# EAGLE design HHPrototype (EAGLE 7.7.0)
HHPrototype

## Sheet 1 of 2: HH Prototype Shield
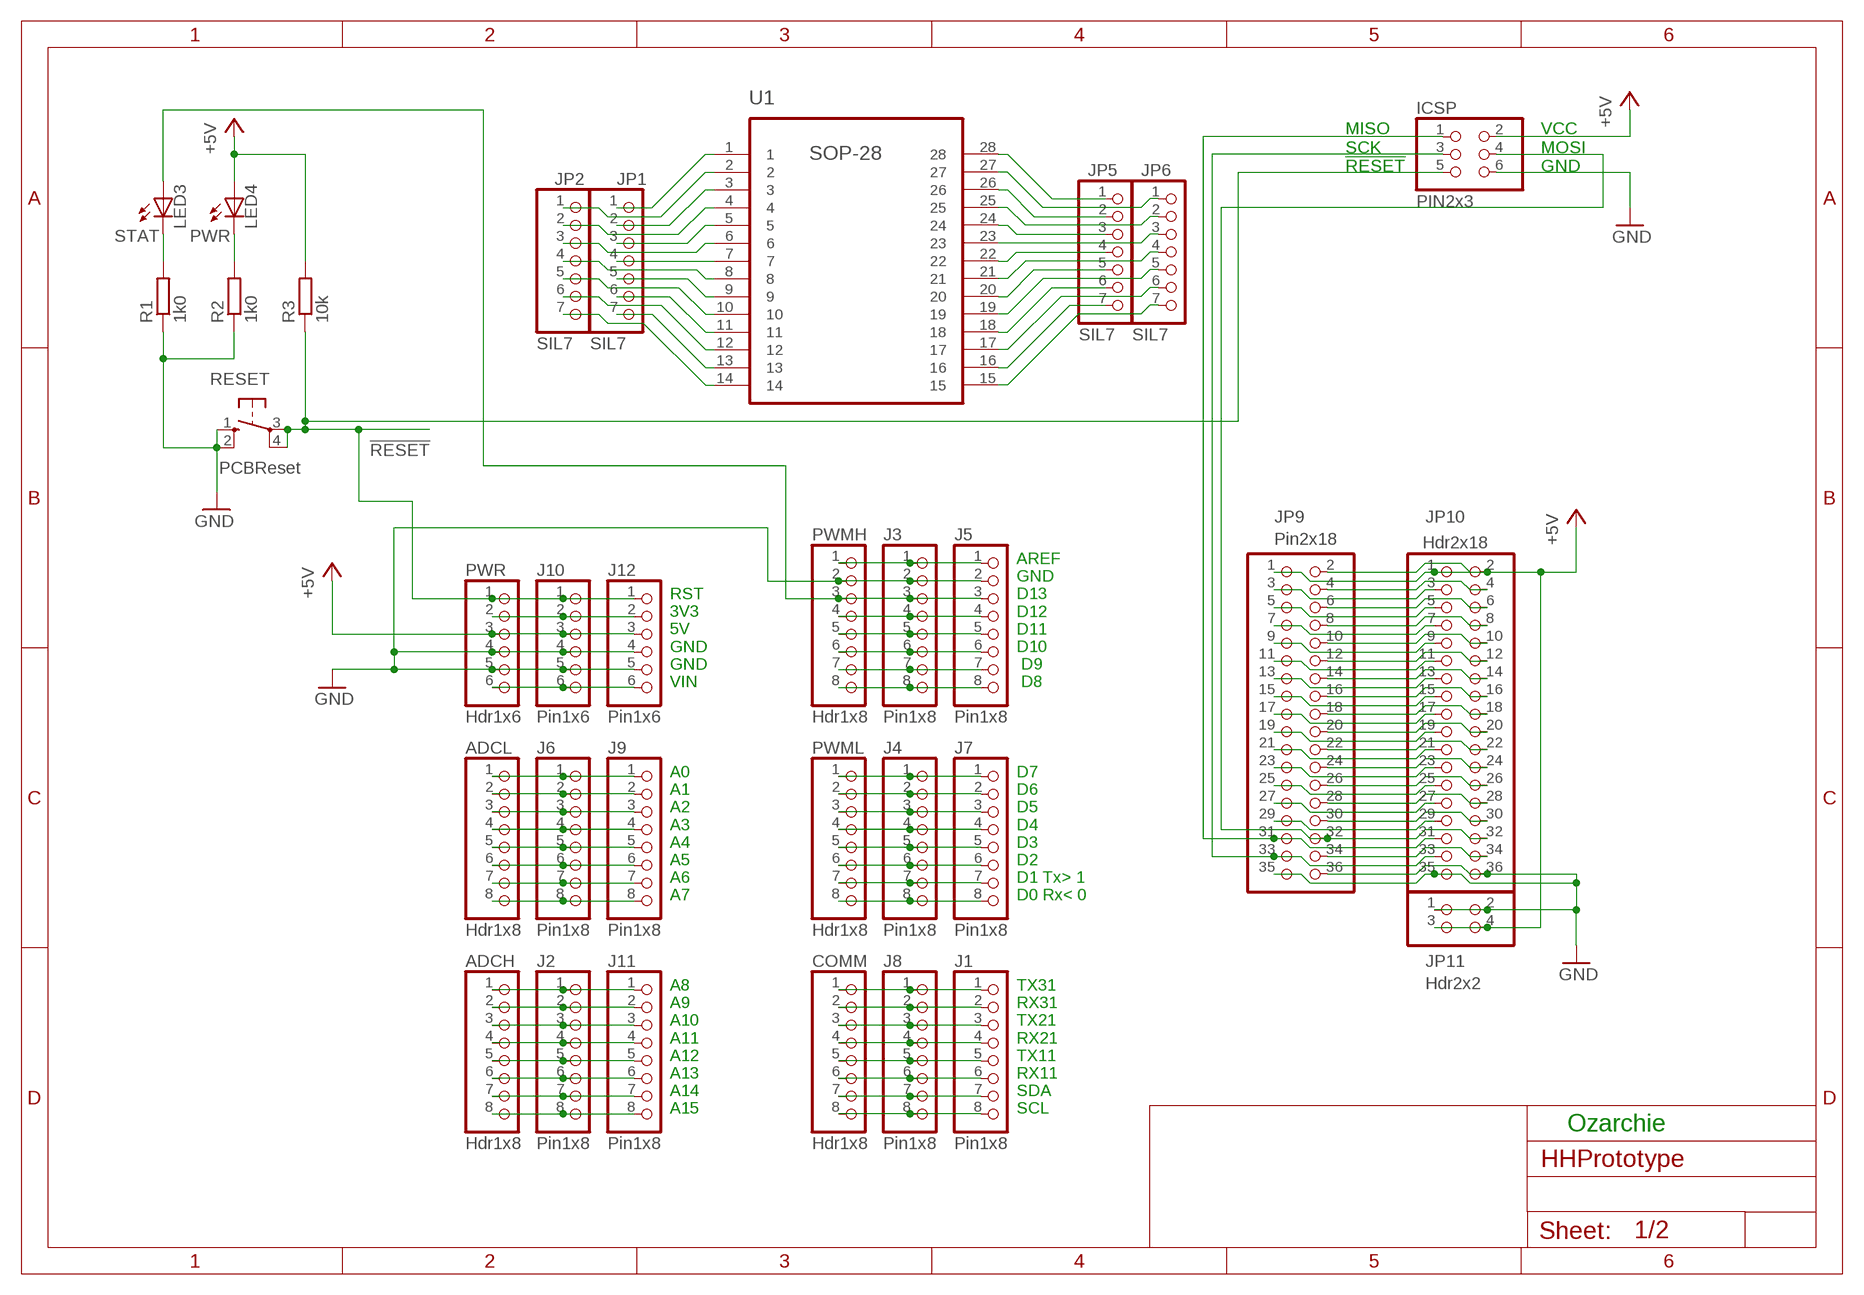
[diagram p0: schematic, sheet 1]

### Parts
ADCH  Hdr1x8  PINHD-1X8  [1X08]
ADCL  Hdr1x8  PINHD-1X8  [1X08]
COMM  Hdr1x8  PINHD-1X8  [1X08]
ICSP  PIN2x3  PINHD-2X3  [2X03]
J1  Pin1x8  PINHD-1X8  [1X08]
J2  Pin1x8  PINHD-1X8  [1X08]
J3  Pin1x8  PINHD-1X8  [1X08]
J4  Pin1x8  PINHD-1X8  [1X08]
J5  Pin1x8  PINHD-1X8  [1X08]
J6  Pin1x8  PINHD-1X8  [1X08]
J7  Pin1x8  PINHD-1X8  [1X08]
J8  Pin1x8  PINHD-1X8  [1X08]
J9  Pin1x8  PINHD-1X8  [1X08]
J10  Pin1x6  PINHD-1X6  [1X06]
J11  Pin1x8  PINHD-1X8  [1X08]
J12  Pin1x6  PINHD-1X6  [1X06]
JP1  SIL7  PINHD-1X7  [1X07]
JP2  SIL7  PINHD-1X7  [1X07]
JP5  SIL7  PINHD-1X7  [1X07]
JP6  SIL7  PINHD-1X7  [1X07]
JP9  Pin2x18  PINHD-2X18  [2X18]
JP10  Hdr2x18  PINHD-2X18  [2X18]
JP11  Hdr2x2  PINHD-2X2  [2X02]
LED3  STAT  LEDCHIPLED_1206  [CHIPLED_1206]
LED4  PWR  LEDCHIPLED_1206  [CHIPLED_1206]
PWMH  Hdr1x8  PINHD-1X8  [1X08]
PWML  Hdr1x8  PINHD-1X8  [1X08]
PWR  Hdr1x6  PINHD-1X6  [1X06]
R1  1k0  R-EU_R0805  [R0805]
R2  1k0  R-EU_R0805  [R0805]
R3  10k  R-EU_R0805  [R0805]
RESET  PCBReset  10-XX  [B3F-10XX]
U1  SOP-28  [SOP50P1030X264-28N]

### Nets
3V3: J10.2 J12.2 PWR.2
!RESET!: ICSP.5 J10.1 J12.1 PWR.1 R3.1 RESET.3(P) RESET.4(P1)
+5V: ICSP.2 J10.3 J12.3 JP9.1 JP9.2 JP10.1 JP10.2 JP11.3 JP11.4 LED4.A PWR.3 R3.2 ; also sheet 2
A0: ADCL.1 J6.1 J9.1
A1: ADCL.2 J6.2 J9.2
A2: ADCL.3 J6.3 J9.3
A3: ADCL.4 J6.4 J9.4
A4: ADCL.5 J6.5 J9.5
A5: ADCL.6 J6.6 J9.6
A6: ADCL.7 J6.7 J9.7
A7: ADCL.8 J6.8 J9.8
A8: ADCH.1 J2.1 J11.1
A9: ADCH.2 J2.2 J11.2
A10: ADCH.3 J2.3 J11.3
A11: ADCH.4 J2.4 J11.4
A12: ADCH.5 J2.5 J11.5
A13: ADCH.6 J2.6 J11.6
A14: ADCH.7 J2.7 J11.7
A15: ADCH.8 J2.8 J11.8
AREF: J3.1 J5.1 PWMH.1
D0/RX0: J4.8 J7.8 PWML.8
D1/TX0: J4.7 J7.7 PWML.7
D2PWM: J4.6 J7.6 PWML.6
D3PWM: J4.5 J7.5 PWML.5
D4PWM: J4.4 J7.4 PWML.4
D5PWM: J4.3 J7.3 PWML.3
D6PWM: J4.2 J7.2 PWML.2
D7PWM: J4.1 J7.1 PWML.1
D8PWM: J3.8 J5.8 PWMH.8
D9PWM: J3.7 J5.7 PWMH.7
D10PWM: J3.6 J5.6 PWMH.6
D11PWM: J3.5 J5.5 PWMH.5
D12PWM: J3.4 J5.4 PWMH.4
D13PWM: J3.3 J5.3 LED3.A PWMH.3
D14/TX3: COMM.1 J1.1 J8.1
D15/RX3: COMM.2 J1.2 J8.2
D16/TX2: COMM.3 J1.3 J8.3
D17/RX2: COMM.4 J1.4 J8.4
D18/TX1: COMM.5 J1.5 J8.5
D19/RX1: COMM.6 J1.6 J8.6
D20/SDA: COMM.7 J1.7 J8.7
D21/SCL: COMM.8 J1.8 J8.8
D22: JP9.3 JP10.3
D23: JP9.4 JP10.4
D24: JP9.5 JP10.5
D25: JP9.6 JP10.6
D26: JP9.7 JP10.7
D27: JP9.8 JP10.8
D28: JP9.9 JP10.9
D29: JP9.10 JP10.10
D30: JP9.11 JP10.11
D31: JP9.12 JP10.12
D32: JP9.13 JP10.13
D33: JP9.14 JP10.14
D34: JP9.15 JP10.15
D35: JP9.16 JP10.16
D36: JP9.17 JP10.17
D37: JP9.18 JP10.18
D38: JP9.19 JP10.19
D39: JP9.20 JP10.20
D40: JP9.21 JP10.21
D41: JP9.22 JP10.22
D42: JP9.23 JP10.23
D43: JP9.24 JP10.24
D44: JP9.25 JP10.25
D45: JP9.26 JP10.26
D46: JP9.27 JP10.27
D47: JP9.28 JP10.28
D48: JP9.29 JP10.29
D49: JP9.30 JP10.30
D53: JP9.34 JP10.34
GND: ICSP.6 J3.2 J5.2 J10.4 J10.5 J12.4 J12.5 JP9.35 JP9.36 JP10.35 JP10.36 JP11.1 JP11.2 PWMH.2 PWR.4 PWR.5 R1.1 R2.1 RESET.1(S) RESET.2(S1) ; also sheet 2
MISO: ICSP.1 JP9.31 JP10.31
MOSI: ICSP.4 JP9.32 JP10.32
N$10: LED3.C R1.2
N$11: LED4.C R2.2
SCK: ICSP.3 JP9.33 JP10.33
SO1: JP1.1 U1.1
SO2: JP2.1 U1.2
SO3: JP1.2 U1.3
SO4: JP2.2 U1.4
SO5: JP1.3 U1.5
SO6: JP2.3 U1.6
SO7: JP1.4 U1.7
SO8: JP2.4 U1.8
SO9: JP1.5 U1.9
SO10: JP2.5 U1.10
SO11: JP1.6 U1.11
SO12: JP2.6 U1.12
SO13: JP1.7 U1.13
SO14: JP2.7 U1.14
SO15: JP6.7 U1.15
SO16: JP5.7 U1.16
SO17: JP6.6 U1.17
SO18: JP5.6 U1.18
SO19: JP6.5 U1.19
SO20: JP5.5 U1.20
SO21: JP6.4 U1.21
SO22: JP5.4 U1.22
SO23: JP6.3 U1.23
SO24: JP5.3 U1.24
SO25: JP6.2 U1.25
SO26: JP5.2 U1.26
SO27: JP6.1 U1.27
SO28: JP5.1 U1.28
VIN: J10.6 J12.6 PWR.6

### Notes on the sheet
- MISO
  SCK
  !RESET!
- VCC
  MOSI
  GND
- RST
  3V3
  5V
  GND
  GND
  VIN
- AREF
  GND
  D13
  D12
  D11
  D10
   D9
   D8
- A0
  A1
  A2
  A3
  A4
  A5
  A6
  A7
- D7
  D6
  D5
  D4
  D3
  D2
  D1 Tx> 1
  D0 Rx< 0
- A8
  A9
  A10
  A11
  A12
  A13
  A14
  A15
- TX31
  RX31
  TX21
  RX21
  TX11
  RX11
  SDA
  SCL
- Ozarchie

## Sheet 2 of 2: HH Prototype Connectors
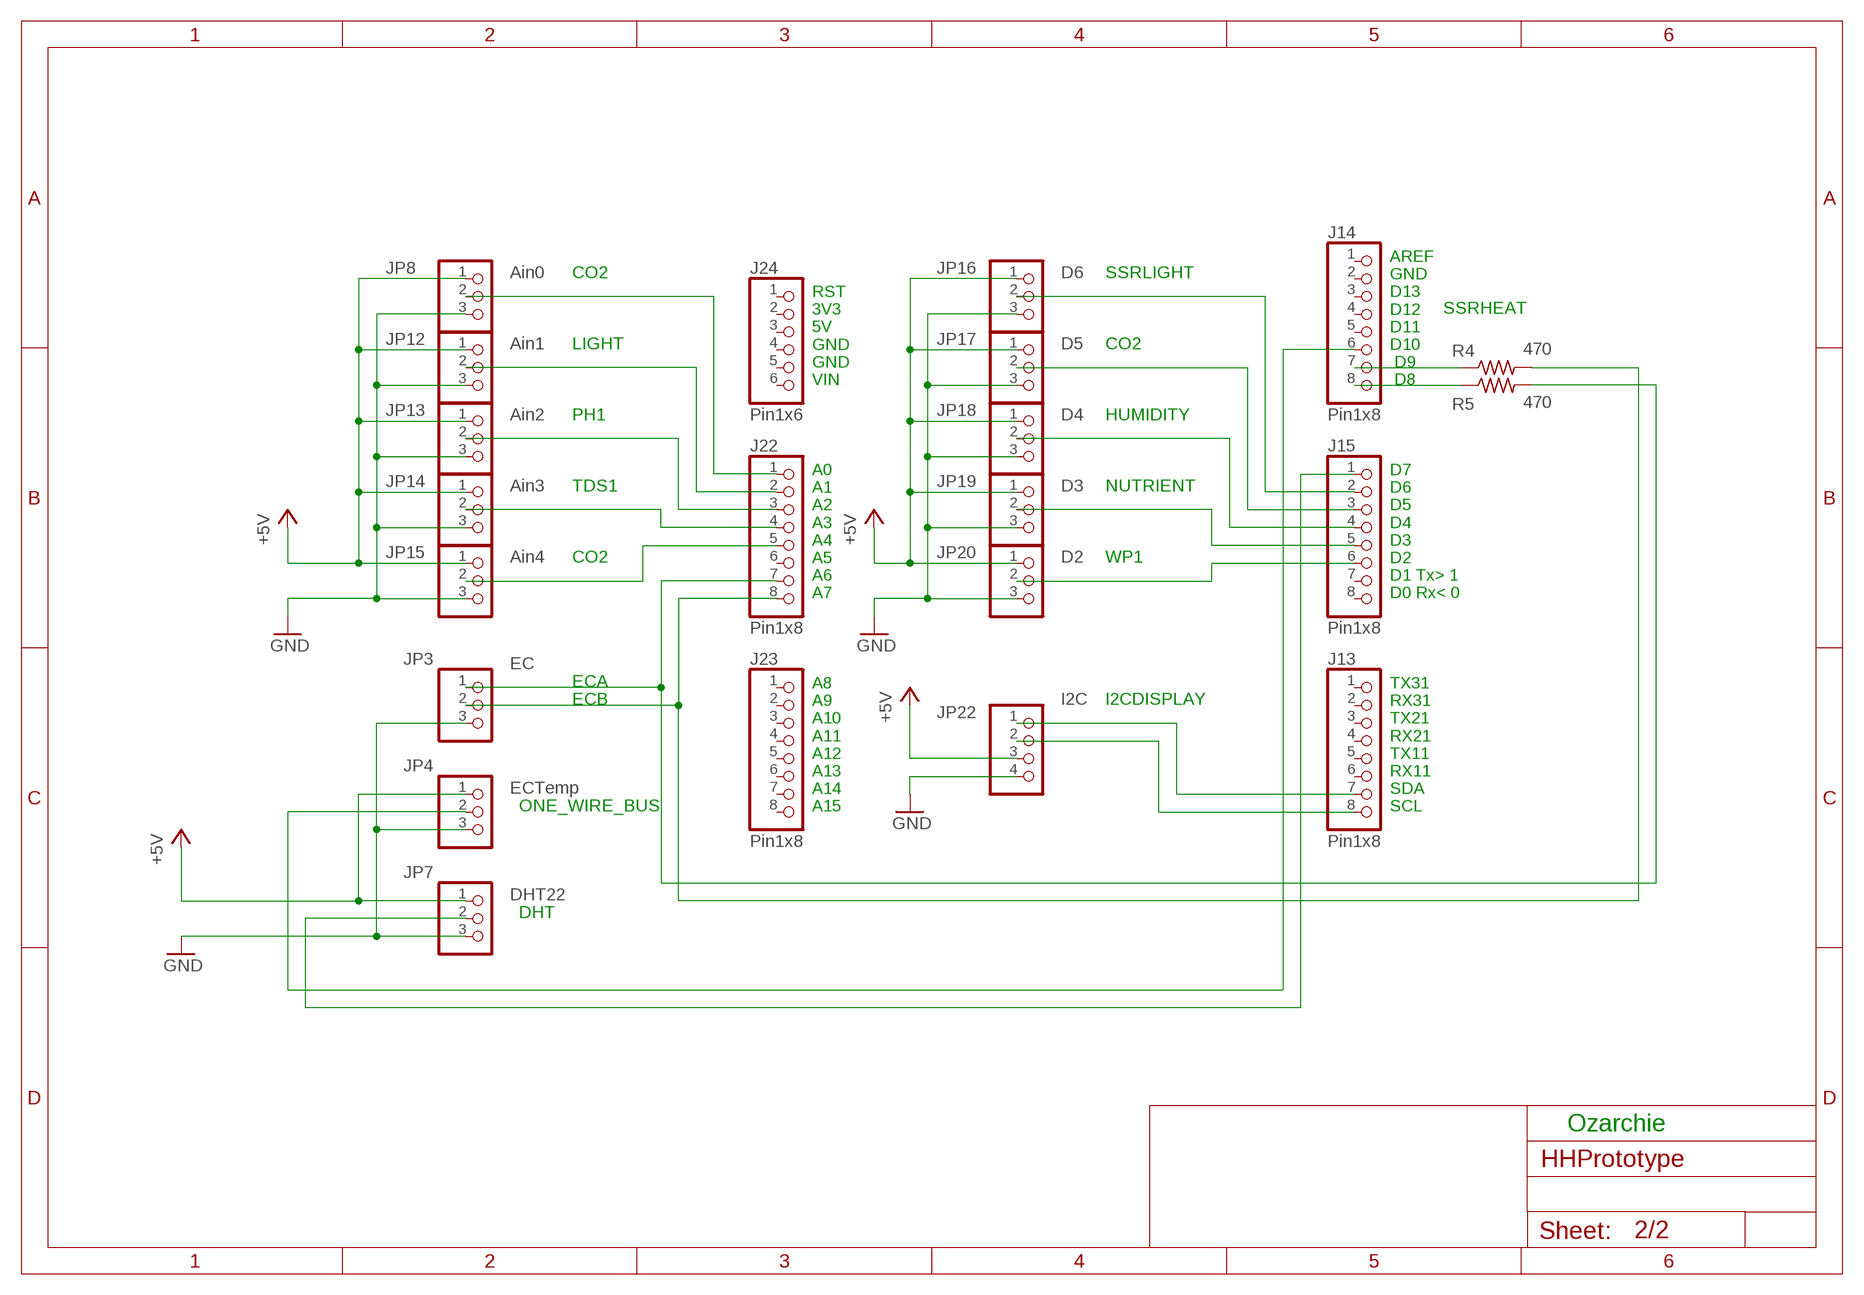
[diagram p1: schematic, sheet 2]

### Parts
J13  Pin1x8  PINHD-1X8  [1X08]
J14  Pin1x8  PINHD-1X8  [1X08]
J15  Pin1x8  PINHD-1X8  [1X08]
J22  Pin1x8  PINHD-1X8  [1X08]
J23  Pin1x8  PINHD-1X8  [1X08]
J24  Pin1x6  PINHD-1X6  [1X06]
JP3  EC  PINHD-1X3  [1X03]
JP4  ECTemp  PINHD-1X3  [1X03]
JP7  DHT22  PINHD-1X3  [1X03]
JP8  Ain0  PINHD-1X3  [1X03]
JP12  Ain1  PINHD-1X3  [1X03]
JP13  Ain2  PINHD-1X3  [1X03]
JP14  Ain3  PINHD-1X3  [1X03]
JP15  Ain4  PINHD-1X3  [1X03]
JP16  D6  PINHD-1X3  [1X03]
JP17  D5  PINHD-1X3  [1X03]
JP18  D4  PINHD-1X3  [1X03]
JP19  D3  PINHD-1X3  [1X03]
JP20  D2  PINHD-1X3  [1X03]
JP22  I2C  PINHD-1X4  [1X04]
R4  470  R-US_0207/2V  [0207/2V]
R5  470  R-US_0207/2V  [0207/2V]

### Nets
+5V: JP4.1 JP7.1 JP8.1 JP12.1 JP13.1 JP14.1 JP15.1 JP16.1 JP17.1 JP18.1 JP19.1 JP20.1 JP22.3 ; also sheet 1
GND: JP3.3 JP4.3 JP7.3 JP8.3 JP12.3 JP13.3 JP14.3 JP15.3 JP16.3 JP17.3 JP18.3 JP19.3 JP20.3 JP22.4 ; also sheet 1
N$1: J22.7 JP3.1 R5.2
N$8: J15.6 JP20.2
N$9: J15.5 JP19.2
N$12: J15.4 JP18.2
N$15: J15.3 JP17.2
N$18: J15.2 JP16.2
N$19: J22.1 JP8.2
N$20: J22.2 JP12.2
N$21: J22.3 JP13.2
N$22: J22.4 JP14.2
N$23: J22.5 JP15.2
N$24: J13.7 JP22.1
N$38: J13.8 JP22.2
N$63: J15.1 JP7.2
N$64: J22.8 JP3.2 R4.2
N$67: J14.7 R4.1
N$68: J14.6 JP4.2
N$88: J14.8 R5.1
Unconnected: J13.1 J13.2 J13.3 J13.4 J13.5 J13.6 J14.1 J14.2 J14.3 J14.4 J14.5 J15.7 J15.8 J22.6 J23.1 J23.2 J23.3 J23.4 J23.5 J23.6 J23.7 J23.8 J24.1 J24.2 J24.3 J24.4 J24.5 J24.6

### Notes on the sheet
- CO2 | SSRLIGHT
- SSRHEAT
- LIGHT | CO2
- RST
  3V3
  5V
  GND
  GND
  VIN
- AREF
  GND
  D13
  D12
  D11
  D10
   D9
   D8
- PH1 | HUMIDITY
- TDS1 | NUTRIENT
- CO2 | WP1
- A0
  A1
  A2
  A3
  A4
  A5
  A6
  A7
- D7
  D6
  D5
  D4
  D3
  D2
  D1 Tx> 1
  D0 Rx< 0
- ECA
- ECB | I2CDISPLAY
- ONE_WIRE_BUS
- A8
  A9
  A10
  A11
  A12
  A13
  A14
  A15
- TX31
  RX31
  TX21
  RX21
  TX11
  RX11
  SDA
  SCL
- DHT
- Ozarchie

## Library data of the parts
ADCH ADCL COMM J1-J9 J11 J13-J15 J22 J23 PWMH PWML = MEGA2560v3ProtoShield:PINHD-1X8: PIN HEADER
ICSP = Smartprj:PINHD-2X3: PIN HEADER
J10 J12 J24 PWR = MEGA2560v3ProtoShield:PINHD-1X6: PIN HEADER
JP1 JP2 JP5 JP6 = MEGA2560v3ProtoShield:PINHD-1X7: PIN HEADER
JP3 JP4 JP7 JP8 JP12-JP20 = adafruit:PINHD-1X3: PIN HEADER
JP9 JP10 = Smartprj:PINHD-2X18: PIN HEADER
JP11 = Smartprj:PINHD-2X2: PIN HEADER
JP22 = pinhead:PINHD-1X4: PIN HEADER
LED3 LED4 = led:LED: LED OSRAM: - CHIPLED LG R971, LG N971, LY N971, LG Q971, LY Q971, LO R971, LY R971 LH N974, LH R974 LS Q976, LO Q976, LY Q976 LO Q996 - Hyper CHIPLED LW Q18S LB Q993, LB Q99A, LB R99A - SideLED LS A670, LO A670, LY A670, LG A670, LP A670 LB A673, LV A673, LT A673, LW A673 LH A674 LY A675 LS A676, LA A676, LO A676, LY A676, LW A676 LS A679, LY A679, LG A679 - Hyper Micro SIDELED® LS Y876, LA Y876, LO Y876, LY Y876 LT Y87S - SmartLED LW L88C, LW L88S LB L89C, LB L89S, LG L890 LS L89K, LO L89K, LY L89K LS L896, LA L896, LO L896, LY L896 - TOPLED LS T670, LO T670, LY T670, LG T670, LP T670 LSG T670, LSP T670, LSY T670, LOP T670, LYG T670 LG T671, LOG T671, LSG T671 LB T673, LV T673, LT T673, LW T673 LH T674 LS T676, LA T676, LO T676, LY T676, LB T676, LH T676, LSB T676, LW T676 LB T67C, LV T67C, LT T67C, LS T67K, LO T67K, LY T67K, LW E67C LS E67B, LA E67B, LO E67B, LY E67B, LB E67C, LV E67C, LT E67C LW T67C LS T679, LY T679, LG T679 LS T770, LO T770, LY T770, LG T770, LP T770 LB T773, LV T773, LT T773, LW T773 LH T774 LS E675, LA E675, LY E675, LS T675 LS T776, LA T776, LO T776, LY T776, LB T776 LHGB T686 LT T68C, LB T68C - Hyper Mini TOPLED® LB M676 - Mini TOPLED Santana® LG M470 LS M47K, LO M47K, LY M47K Source: http://www.osram.convergy.de LUXEON: - LUMILED® LXK2-PW12-R00, LXK2-PW12-S00, LXK2-PW14-U00, LXK2-PW14-V00 LXK2-PM12-R00, LXK2-PM12-S00, LXK2-PM14-U00 LXK2-PE12-Q00, LXK2-PE12-R00, LXK2-PE12-S00, LXK2-PE14-T00, LXK2-PE14-U00 LXK2-PB12-K00, LXK2-PB12-L00, LXK2-PB12-M00, LXK2-PB14-N00, LXK2-PB14-P00, LXK2-PB14-Q00 LXK2-PR12-L00, LXK2-PR12-M00, LXK2-PR14-Q00, LXK2-PR14-R00 LXK2-PD12-Q00, LXK2-PD12-R00, LXK2-PD12-S00 LXK2-PH12-R00, LXK2-PH12-S00 LXK2-PL12-P00, LXK2-PL12-Q00, LXK2-PL12-R00 Source: www.luxeon.com KINGBRIGHT: KA-3528ASYC Source: www.kingbright.com
R1-R3 = resistor:R-EU_: RESISTOR, European symbol
R4 R5 = adafruit:R-US_: RESISTOR, American symbol
RESET = switch-omron:10-XX: OMRON SWITCH; MPN: B3F-1000; OC_FARNELL: 176432; OC_NEWARK: 36M3542
U1 = pmc:SOP-28: SOP28 PAD Pattern

## Board
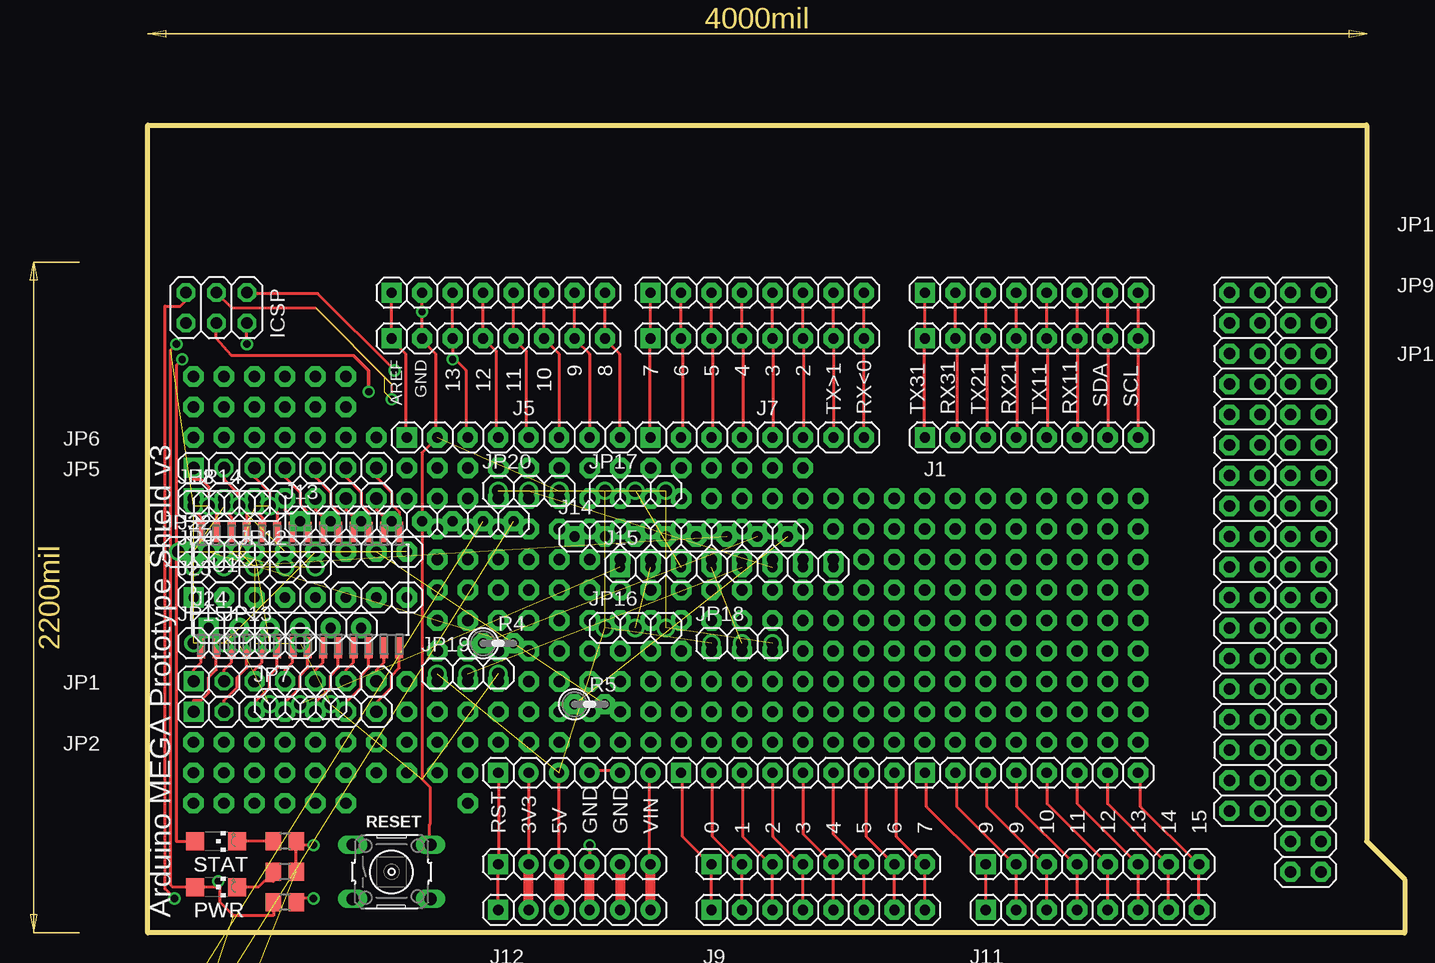
[diagram p2: board, top side]
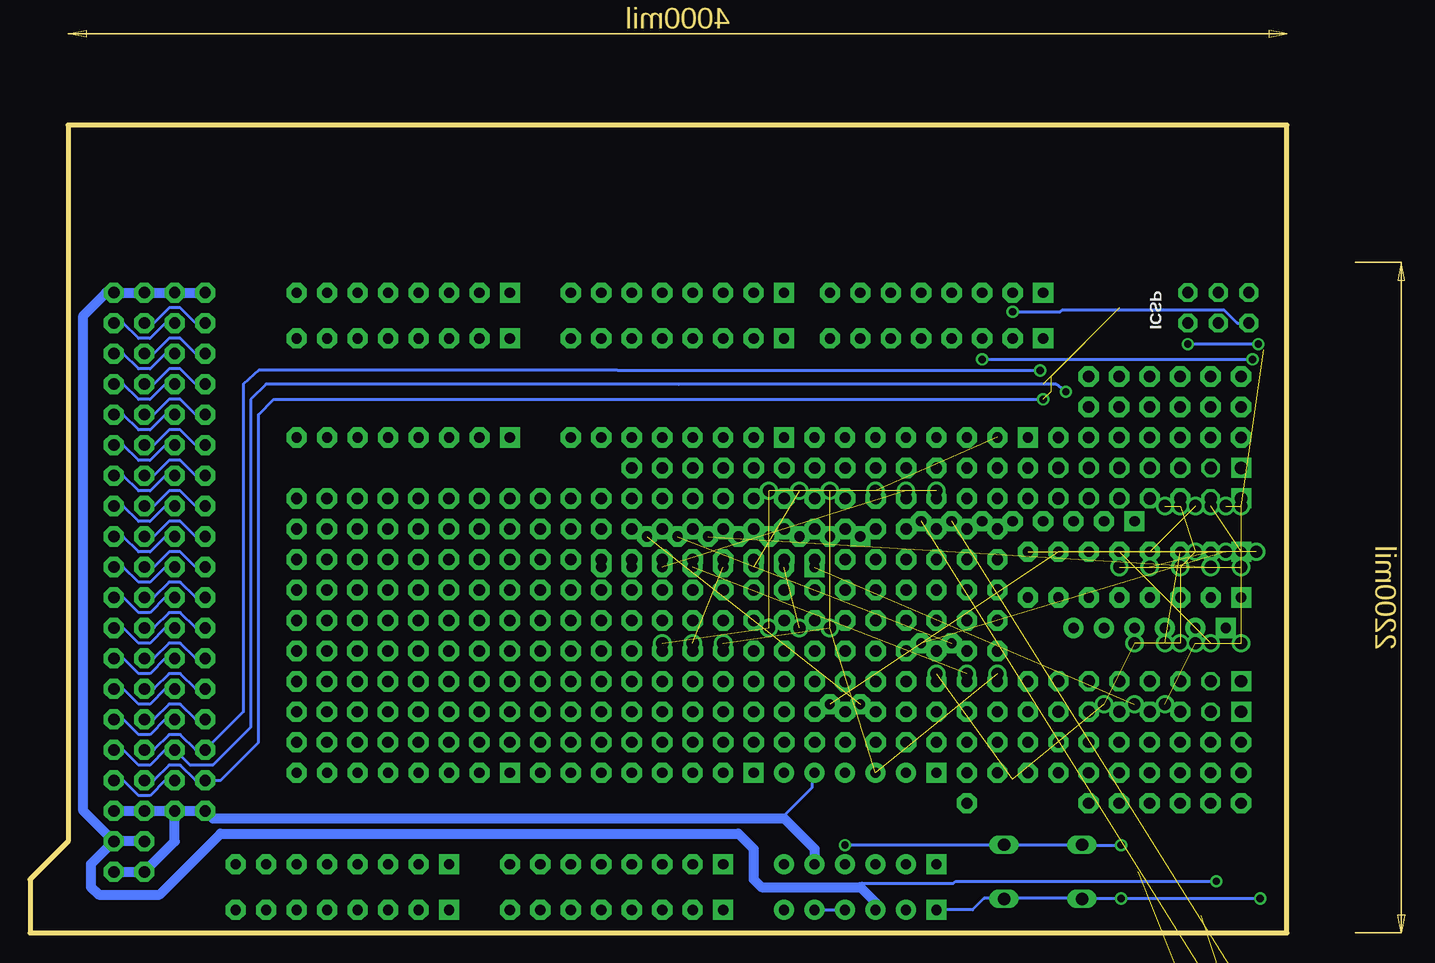
[diagram p3: board, bottom side, seen from below]

Size 104.78 x 67.31 mm. Coordinates in mm from the lower left corner, seen from the top.
Outline: 0,0 0,67.31 101.6,67.31 101.6,7.62 104.78,4.45 104.78,0 0,0
Copper layers (1*16): Top 0.035mm / dielectric 1.5mm / Bottom 0.035mm
Design rules "default *": minimum track width 10mil, minimum drill 24mil, track to track 8mil, track to pad 8mil, pad to pad 8mil, via to via 8mil, smd to smd 8mil, copper to edge 40mil, drill to drill 8mil, minimum pad ring 10mil, minimum via ring 8mil, stop-mask expansion 2mil, vias tented up to drill 0mil, thermal gap 10mil

### Footprints (pad centres in the part's own frame; a part is rotated, then mirrored left to right if it is on the bottom)
1X08 = drill 0.85 pad 1.676 square: 1 -8.89,0 | drill 0.85 pad 1.676 octagon: 2 -6.35,0; 3 -3.81,0; 4 -1.27,0; 5 1.27,0; 6 3.81,0; 7 6.35,0; 8 8.89,0
2X03 = drill 0.95 pad 1.55 octagon: 1 -2.54,-1.27; 2 -2.54,1.27; 3 0,-1.27; 4 0,1.27; 5 2.54,-1.27; 6 2.54,1.27
1X06 = drill 0.85 pad 1.676 square: 1 -6.35,0 | drill 0.85 pad 1.676: 2 -3.81,0; 3 -1.27,0; 4 1.27,0; 5 3.81,0; 6 6.35,0
1X07 = drill 1.016 pad 1.676 square: 1 -7.62,0 | drill 1.016 octagon: 2 -5.08,0 | drill 1.016 pad 1.676 octagon: 3 -2.54,0; 4 0,0; 5 2.54,0; 6 5.08,0; 7 7.62,0
1X03 = drill 1.016: 1 -2.54,0; 2 0,0; 3 2.54,0
2X18 = drill 0.95 pad 1.676 octagon: 1 -21.59,-1.27; 2 -21.59,1.27; 3 -19.05,-1.27; 4 -19.05,1.27; 5 -16.51,-1.27; 6 -16.51,1.27; 7 -13.97,-1.27; 8 -13.97,1.27; 9 -11.43,-1.27; 10 -11.43,1.27; 11 -8.89,-1.27; 12 -8.89,1.27; 13 -6.35,-1.27; 14 -6.35,1.27; 15 -3.81,-1.27; 16 -3.81,1.27; 17 -1.27,-1.27; 18 -1.27,1.27; 19 1.27,-1.27; 20 1.27,1.27; 21 3.81,-1.27; 22 3.81,1.27; 23 6.35,-1.27; 24 6.35,1.27; 25 8.89,-1.27; 26 8.89,1.27; 27 11.43,-1.27; 28 11.43,1.27; 29 13.97,-1.27; 30 13.97,1.27; 31 16.51,-1.27; 32 16.51,1.27; 33 19.05,-1.27; 34 19.05,1.27; 35 21.59,-1.27; 36 21.59,1.27
2X02 = drill 0.95 pad 1.676 octagon: 1 -1.27,-1.27; 2 -1.27,1.27; 3 1.27,-1.27; 4 1.27,1.27
1X04 = drill 1.016 long: 1 -3.81,0; 2 -1.27,0; 3 1.27,0; 4 3.81,0
CHIPLED_1206 = smd 1.5 x 1.5: A 0,-1.75; C 0,1.75
R0805 = smd 1.3 x 1.5: 1 -0.95,0; 2 0.95,0
0207/2V = drill 0.813 pad 1.676 octagon: 1 -1.27,0; 2 1.27,0
B3F-10XX = drill 1.016 long: 1 -3.251,2.261; 2 3.251,2.261; 3 -3.251,-2.261; 4 3.251,-2.261
SOP50P1030X264-28N = smd 1.727 x 0.66: 1 -4.826,8.255; 2 -4.826,6.985; 3 -4.826,5.715; 4 -4.826,4.445; 5 -4.826,3.175; 6 -4.826,1.905; 7 -4.826,0.635; 8 -4.826,-0.635; 9 -4.826,-1.905; 10 -4.826,-3.175; 11 -4.826,-4.445; 12 -4.826,-5.715; 13 -4.826,-6.985; 14 -4.826,-8.255; 15 4.826,-8.255; 16 4.826,-6.985; 17 4.826,-5.715; 18 4.826,-4.445; 19 4.826,-3.175; 20 4.826,-1.905; 21 4.826,-0.635; 22 4.826,0.635; 23 4.826,1.905; 24 4.826,3.175; 25 4.826,4.445; 26 4.826,5.715; 27 4.826,6.985; 28 4.826,8.255

### Placement (x,y rotation side)
ADCH  78.74,1.91 0 top
ADCL  55.88,1.91 0 top
COMM  73.66,49.53 0 top
ICSP  5.71,52.07 180 top
J1  73.66,41.27 0 top
J2  78.74,5.71 0 top
J3  29.21,53.34 0 top
J4  50.8,53.34 0 top
J5  30.48,41.27 0 top
J6  55.88,5.71 0 top
J7  50.8,41.27 0 top
J8  73.66,53.34 0 top
J9  53.34,13.34 0 top
J10  35.56,5.71 0 top
J11  73.66,13.34 0 top
J12  35.56,13.34 0 top
J13  21.59,34.29 0 top
J14  44.45,33.02 0 top
J15  48.26,30.48 0 top
J22  12.7,31.75 0 top
J23  12.7,27.94 0 top
J24  11.43,25.4 0 top
JP1  11.43,20.95 0 top
JP2  11.43,18.41 0 top
JP3  5.08,31.75 0 top
JP4  6.35,30.48 0 top
JP5  11.43,36.2 0 top
JP6  11.43,38.73 0 top
JP7  12.7,19.05 0 top
JP8  6.35,35.56 0 top
JP9  96.52,31.75 270 top
JP10  91.44,31.75 270 top
JP11  96.52,6.35 90 top
JP12  11.43,30.48 0 top
JP13  10.16,24.13 0 top
JP14  7.62,35.56 0 top
JP15  6.35,24.13 0 top
JP16  40.64,25.4 0 top
JP17  40.64,36.83 0 top
JP18  49.53,24.13 0 top
JP19  26.67,21.59 0 top
JP20  31.75,36.83 0 top
JP22  0,-16.51 0 top  (outside the outline)
LED3  5.71,7.62 270 top
LED4  5.71,3.81 270 top
PWMH  29.21,49.53 0 top
PWML  50.8,49.53 0 top
PWR  35.56,1.91 0 top
R1  11.43,7.62 180 top
R2  11.43,5.08 180 top
R3  11.43,2.54 180 top
R4  29.21,24.13 0 top
R5  36.83,19.05 0 top
RESET  20.32,5.08 0 top
U1  12.7,28.57 90 top

### Tracks (layer width: path | path; a pad name or v marks a point on that pad's centre or on a via)
3V3
  Top 0.254: J12.2 31.77,13.26 31.77,5.94 J10.2
  Top 0.813: PWR.2 J10.2
!RESET!  (via drill 0.61)
  Top 0.254: PWR.1 J10.1 29.26,5.71 29.26,13.26 J12.1 | v13.81,2.86 12.7,2.86 R3.1 | ICSP.5 3.17,52.7 2.7,52.23 1.43,52.23 1.43,3.65 v2.22,2.86
  Bottom 0.254: v2.22,2.86 v13.81,2.86 16.99,2.86 RESET.3 17.14,2.86 23.5,2.86 RESET.4 23.65,2.86 25.24,2.86 26.19,1.91 PWR.1
+5V  (via drill 0.61)  (13 unrouted)
  Top 0.254: 5.87,3.81 6.03,3.81 6.03,2.54 7.14,1.43 10.48,1.43 R3.2 | 5.87,3.81 LED4.A 2.06,3.81 1.91,3.97 1.91,48.58 v2.38,49.05 | v8.26,49.05 ICSP.2 | v5.87,4.29 5.87,3.81 | J10.3 J12.3
  Top 0.813: J10.3 PWR.3
  Bottom 0.254: v2.38,49.05 v8.26,49.05 | v5.87,4.29 27.62,4.29 27.78,4.13 35.4,4.13 35.56,3.81
  Bottom 0.813: JP11.3 100.33,10.16 100.33,51.44 98.42,53.34 JP9.2 JP9.1 JP10.2 JP10.1 | PWR.3 34.29,2.54 35.56,3.81 43.81,3.81 44.45,4.45 44.45,6.99 45.72,8.26 88.9,8.26 93.98,3.17 99.06,3.17 99.69,3.81 99.69,5.71 JP11.3 | JP11.4 JP11.3
A0
  Top 0.254: ADCL.1 J6.1 46.86,5.71 44.58,8 44.58,13.26 J9.1
A1
  Top 0.254: ADCL.2 J6.2 49.38,5.71 47.09,8 47.09,13.26 J9.2
A2
  Top 0.254: ADCL.3 J6.3 51.89,5.71 49.61,8 49.61,13.26 J9.3
A3
  Top 0.254: ADCL.4 J6.4 54.41,5.71 52.12,8 52.12,13.26 J9.4
A4
  Top 0.254: ADCL.5 J6.5 54.63,8.23 54.63,13.26 J9.5
A5
  Top 0.254: ADCL.6 J6.6 59.66,5.71 57.15,8.23 J9.6
A6
  Top 0.254: ADCL.7 J6.7 62.18,5.71 59.89,8 59.89,13.26 J9.7
A7
  Top 0.254: ADCL.8 J6.8 64.69,5.71 62.41,8 62.41,13.26 J9.8
A8
  Top 0.254: ADCH.1 J2.1 69.72,5.71 64.92,10.52 64.92,13.26 J11.1
A9
  Top 0.254: ADCH.2 J2.2 72.24,5.71 67.44,10.52 67.44,13.26 J11.2
A10
  Top 0.254: ADCH.3 J2.3 74.75,5.71 69.95,10.52 69.95,13.26 J11.3
A11
  Top 0.254: ADCH.4 J2.4 77.27,5.71 72.47,10.52 72.47,13.26 J11.4
A12
  Top 0.254: ADCH.5 J2.5 74.98,10.74 74.98,13.26 J11.5
A13
  Top 0.254: ADCH.6 J2.6 82.53,5.71 77.5,10.74 77.5,13.26 J11.6
A14
  Top 0.254: ADCH.7 J2.7 85.04,5.71 80.01,10.74 J11.7
A15
  Top 0.254: ADCH.8 J2.8 87.55,5.71 82.75,10.52 82.75,13.26 J11.8
AREF
  Top 0.254: J3.1 PWMH.1 20.34,49.38 21.49,48.23 21.49,41.38 J5.1
D0/RX0
  Top 0.254: J4.8 PWML.8 59.66,49.38 59.66,41.38 J7.8
D1/TX0
  Top 0.254: J4.7 PWML.7 J7.7
D2PWM
  Top 0.254: J4.6 PWML.6 54.63,49.38 54.63,41.38 J7.6
D3PWM
  Top 0.254: J4.5 PWML.5 52.12,49.38 52.12,41.38 J7.5
D4PWM
  Top 0.254: J4.4 PWML.4 49.61,49.38 49.61,41.38 J7.4
D5PWM
  Top 0.254: J4.3 PWML.3 47.09,49.38 47.09,41.38 J7.3
D6PWM
  Top 0.254: J4.2 PWML.2 44.58,49.38 44.58,41.38 J7.2
D7PWM
  Top 0.254: J4.1 PWML.1 41.83,49.38 41.83,41.38 J7.1
D8PWM
  Top 0.254: J3.8 PWMH.8 38.18,49.38 39.32,48.23 39.32,41.38 J5.8
D9PWM
  Top 0.254: J3.7 PWMH.7 35.66,49.38 36.8,48.23 36.8,41.38 J5.7
D10PWM
  Top 0.254: J3.6 PWMH.6 33.15,49.38 34.29,48.23 J5.6
D11PWM
  Top 0.254: J3.5 PWMH.5 31.55,48.46 31.55,41.38 J5.5
D12PWM
  Top 0.254: J3.4 PWMH.4 28.12,49.38 29.03,48.46 29.03,41.38 J5.4
D13PWM  (via drill 0.61)
  Top 0.254: J3.3 PWMH.3 v25.4,47.78 25.6,47.78 26.52,46.86 26.52,41.38 J5.3 | LED3.A 2.38,7.62 2.38,47.31 v2.86,47.78
  Bottom 0.254: v25.4,47.78 v2.86,47.78
D14/TX3
  Top 0.254: J8.1 COMM.1 64.69,49.38 64.69,41.38 J1.1
D15/RX3
  Top 0.254: J8.2 COMM.2 67.44,49.38 67.44,41.38 J1.2
D16/TX2
  Top 0.254: J8.3 COMM.3 69.95,49.38 69.95,41.38 J1.3
D17/RX2
  Top 0.254: J8.4 COMM.4 72.47,49.38 72.47,41.38 J1.4
D18/TX1
  Top 0.254: J8.5 COMM.5 74.98,49.38 74.98,41.38 J1.5
D19/RX1
  Top 0.254: J8.6 COMM.6 77.5,49.38 77.5,41.38 J1.6
D20/SDA
  Top 0.254: J8.7 COMM.7 J1.7
D21/SCL
  Top 0.254: J8.8 COMM.8 82.53,49.38 82.53,41.38 J1.8
D22
  Bottom 0.254: JP9.3 94.46,50.8 93.19,52.07 92.23,52.07 90.96,50.8 JP10.3
D23
  Bottom 0.254: JP9.4 97,50.8 95.73,49.53 94.77,49.53 93.5,50.8 JP10.4
D24
  Bottom 0.254: JP9.5 94.46,48.26 93.19,49.53 92.23,49.53 90.96,48.26 JP10.5
D25
  Bottom 0.254: JP9.6 97,48.26 95.73,46.99 94.77,46.99 93.5,48.26 JP10.6
D26
  Bottom 0.254: JP9.7 94.46,45.72 93.19,46.99 92.23,46.99 90.96,45.72 JP10.7
D27
  Bottom 0.254: JP9.8 97,45.72 95.73,44.45 94.77,44.45 93.5,45.72 JP10.8
D28
  Bottom 0.254: JP9.9 94.46,43.18 93.19,44.45 92.23,44.45 90.96,43.18 JP10.9
D29
  Bottom 0.254: JP9.10 97,43.18 95.73,41.91 94.77,41.91 93.5,43.18 JP10.10
D30
  Bottom 0.254: JP9.11 94.46,40.64 93.19,41.91 92.23,41.91 90.96,40.64 JP10.11
D31
  Bottom 0.254: JP9.12 97,40.64 95.73,39.37 94.77,39.37 93.5,40.64 JP10.12
D32
  Bottom 0.254: JP9.13 94.46,38.1 93.19,39.37 92.23,39.37 90.96,38.1 JP10.13
D33
  Bottom 0.254: JP9.14 97,38.1 95.73,36.83 94.77,36.83 93.5,38.1 JP10.14
D34
  Bottom 0.254: JP9.15 94.46,35.56 93.19,36.83 92.23,36.83 90.96,35.56 JP10.15
D35
  Bottom 0.254: JP9.16 97,35.56 95.73,34.29 94.77,34.29 93.5,35.56 JP10.16
D36
  Bottom 0.254: JP9.17 94.46,33.02 93.19,34.29 92.23,34.29 90.96,33.02 JP10.17
D37
  Bottom 0.254: JP9.18 97,33.02 95.73,31.75 94.77,31.75 93.5,33.02 JP10.18
D38
  Bottom 0.254: JP9.19 94.46,30.48 93.19,31.75 92.23,31.75 90.96,30.48 JP10.19
D39
  Bottom 0.254: JP9.20 97,30.48 95.73,29.21 94.77,29.21 93.5,30.48 JP10.20
D40
  Bottom 0.254: JP9.21 94.46,27.94 93.19,29.21 92.23,29.21 90.96,27.94 JP10.21
D41
  Bottom 0.254: JP9.22 97,27.94 95.73,26.67 94.77,26.67 93.5,27.94 JP10.22
D42
  Bottom 0.254: JP9.23 94.46,25.4 93.19,26.67 92.23,26.67 90.96,25.4 JP10.23
D43
  Bottom 0.254: JP9.24 97,25.4 95.73,24.13 94.77,24.13 93.5,25.4 JP10.24
D44
  Bottom 0.254: JP9.25 94.46,22.86 93.19,24.13 92.23,24.13 90.96,22.86 JP10.25
D45
  Bottom 0.254: JP9.26 97,22.86 95.73,21.59 94.77,21.59 93.5,22.86 JP10.26
D46
  Bottom 0.254: JP9.27 94.46,20.32 93.19,21.59 92.23,21.59 90.96,20.32 JP10.27
D47
  Bottom 0.254: JP9.28 97,20.32 95.73,19.05 94.77,19.05 93.5,20.32 JP10.28
D48
  Bottom 0.254: JP9.29 94.46,17.78 93.19,19.05 92.23,19.05 90.96,17.78 JP10.29
D49
  Bottom 0.254: JP9.30 97,17.78 95.73,16.51 94.77,16.51 93.5,17.78 JP10.30
D53
  Bottom 0.254: JP9.34 97,12.7 95.73,11.43 94.77,11.43 93.5,12.7 JP10.34
GND  (via drill 0.61)  (14 unrouted)
  Top 0.254: 12.38,7.3 R2.1 | 12.38,7.3 R1.1 12.38,7.3 | v13.81,7.3 12.38,7.3 | v36.83,7.3 J10.4 | RESET.2 23.5,7.46 23.5,9.05 23.55,9.14 23.55,12.12 22.86,12.8 22.86,40.01 J5.2 24,41.38 24,48.23 22.86,49.38 PWMH.2 v22.86,51.75 J3.2 | J12.4 37.03,13.49 39.32,13.49 J12.5
  Top 0.813: J10.5 PWR.5 | PWR.4 J10.4
  Bottom 0.254: ICSP.6 4.13,50.8 5.24,51.91 18.73,51.91 18.89,51.75 v22.86,51.75 | PWR.5 PWR.4 | v13.81,7.3 16.99,7.3 RESET.1 17.14,7.3 23.5,7.3 RESET.2 23.65,7.3 v36.83,7.3 | J12.5 39.55,13.26 39.55,12.12 41.83,9.83 41.91,9.53
  Bottom 0.813: JP9.36 JP9.35 JP10.36 | JP10.36 JP10.35 89.53,9.53 41.91,9.53 39.37,6.99 J10.5 | JP11.1 JP11.2 92.71,7.62 JP10.36
MISO  (via drill 0.61)
  Top 0.254: v20.57,46.86 14.17,53.26 8.46,53.26 ICSP.1
  Bottom 0.254: JP9.31 94.46,15.24 93.19,16.51 92.23,16.51 90.96,15.24 JP10.31 87,18.41 87,45.72 85.72,46.86 55.78,46.86 v20.57,46.86
MOSI  (via drill 0.61)
  Top 0.254: 17.14,48.1 6.99,48.1 5.71,49.53 ICSP.4
  Top 0.305: v18.41,45.09 18.41,46.83 17.14,48.1
  Bottom 0.254: JP9.32 97,15.24 95.73,13.97 94.77,13.97 93.5,15.24 JP10.32 91.44,13.97 89.53,13.97 86.36,17.14 86.36,44.45 85.09,45.72 50.67,45.7 19.23,45.7 v18.41,45.09
N$1  (2 unrouted)
N$4  (via drill 0.95 pad 1.7)
  other vias: 72.39,15.88
N$8  (1 unrouted)
N$9  (1 unrouted)
N$10
  Top 0.254: R1.2 LED3.C
N$11
  Top 0.254: LED4.C 9.21,3.81 9.68,4.29 10.48,4.29 R2.2
N$12  (1 unrouted)
N$13  (via drill 0.95 pad 1.7)
  other vias: 6.35,41.27
N$14  (via drill 0.95 pad 1.7)
  other vias: 3.81,41.27
N$15  (1 unrouted)
N$16  (via drill 0.95 pad 1.7)
  other vias: 6.35,43.81
N$17  (via drill 0.95 pad 1.7)
  other vias: 6.35,46.35
N$18  (1 unrouted)
N$19  (1 unrouted)
N$20  (1 unrouted)
N$21  (1 unrouted)
N$22  (1 unrouted)
N$23  (1 unrouted)
N$24  (1 unrouted)
N$25  (via drill 0.95 pad 1.7)
  other vias: 8.89,41.27
N$26  (via drill 0.95 pad 1.7)
  other vias: 11.43,41.27
N$27  (via drill 0.95 pad 1.7)
  other vias: 16.51,41.27
N$28  (via drill 0.95 pad 1.7)
  other vias: 13.97,41.27
N$29  (via drill 0.95 pad 1.7)
  other vias: 13.97,43.81
N$30  (via drill 0.95 pad 1.7)
  other vias: 11.43,43.81
N$31  (via drill 0.95 pad 1.7)
  other vias: 8.89,43.81
N$32  (via drill 0.95 pad 1.7)
  other vias: 8.89,46.35
N$33  (via drill 0.95 pad 1.7)
  other vias: 11.43,46.35
N$34  (via drill 0.95 pad 1.7)
  other vias: 16.51,43.81
N$35  (via drill 0.95 pad 1.7)
  other vias: 16.51,46.35
N$36  (via drill 0.95 pad 1.7)
  other vias: 13.97,46.35
N$37  (via drill 0.95 pad 1.7)
  other vias: 3.81,43.81
N$38  (1 unrouted)
N$39  (via drill 0.95 pad 1.7)
  other vias: 3.81,46.35
N$40  (via drill 0.95 pad 1.7)
  other vias: 6.35,10.79
N$41  (via drill 0.95 pad 1.7)
  other vias: 3.81,10.79
N$42  (via drill 0.95 pad 1.7)
  other vias: 6.35,13.34
N$43  (via drill 0.95 pad 1.7)
  other vias: 6.35,15.88
N$44  (via drill 0.95 pad 1.7)
  other vias: 8.89,10.79
N$45  (via drill 0.95 pad 1.7)
  other vias: 64.77,15.88
N$46  (via drill 0.95 pad 1.7)
  other vias: 64.77,31.11
N$47  (via drill 0.95 pad 1.7)
  other vias: 64.77,28.57
N$48  (via drill 0.95 pad 1.7)
  other vias: 11.43,10.79
N$49  (via drill 0.95 pad 1.7)
  other vias: 64.77,26.04
N$50  (via drill 0.95 pad 1.7)
  other vias: 13.97,10.79
N$51  (via drill 0.95 pad 1.7)
  other vias: 13.97,13.34
N$52  (via drill 0.95 pad 1.7)
  other vias: 11.43,13.34
N$53  (via drill 0.95 pad 1.7)
  other vias: 8.89,13.34
N$54  (via drill 0.95 pad 1.7)
  other vias: 8.89,15.88
N$55  (via drill 0.95 pad 1.7)
  other vias: 11.43,15.88
N$56  (via drill 0.95 pad 1.7)
  other vias: 16.51,13.34
N$57  (via drill 0.95 pad 1.7)
  other vias: 64.77,23.5
N$58  (via drill 0.95 pad 1.7)
  other vias: 64.77,20.95
N$59  (via drill 0.95 pad 1.7)
  other vias: 64.77,18.41
N$60  (via drill 0.95 pad 1.7)
  other vias: 16.51,15.88
N$61  (via drill 0.95 pad 1.7)
  other vias: 13.97,15.88
N$62  (via drill 0.95 pad 1.7)
  other vias: 3.81,13.34
N$63  (1 unrouted)
N$64  (2 unrouted)
N$65  (via drill 0.95 pad 1.7)
  other vias: 3.81,15.88
N$66  (via drill 0.95 pad 1.7)
  other vias: 19.05,41.27
N$67  (1 unrouted)
N$68  (1 unrouted)
N$71  (via drill 0.95 pad 1.7)
  other vias: 26.67,13.34
N$72  (via drill 0.95 pad 1.7)
  other vias: 24.13,36.2
N$73  (via drill 0.95 pad 1.7)
  other vias: 21.59,36.2
N$74  (via drill 0.95 pad 1.7)
  other vias: 24.13,38.73
N$75  (via drill 0.95 pad 1.7)
  other vias: 21.59,38.73
N$76  (via drill 0.95 pad 1.7)
  other vias: 64.77,33.66
N$77  (via drill 0.95 pad 1.7)
  other vias: 26.67,10.79
N$78  (via drill 0.95 pad 1.7)
  other vias: 24.13,13.34
N$79  (via drill 0.95 pad 1.7)
  other vias: 24.13,15.88
N$80  (via drill 0.95 pad 1.7)
  other vias: 24.13,18.41
N$81  (via drill 0.95 pad 1.7)
  other vias: 59.69,15.88
N$82  (via drill 0.95 pad 1.7)
  other vias: 29.21,15.88
N$83  (via drill 0.95 pad 1.7)
  other vias: 26.67,15.88
N$84  (via drill 0.95 pad 1.7)
  other vias: 24.13,20.95
N$85  (via drill 0.95 pad 1.7)
  other vias: 24.13,23.5
N$86  (via drill 0.95 pad 1.7)
  other vias: 24.13,26.04
N$87  (via drill 0.95 pad 1.7)
  other vias: 24.13,31.11
N$88  (1 unrouted)
N$90  (via drill 0.95 pad 1.7)
  other vias: 24.13,33.66
N$91  (via drill 0.95 pad 1.7)
  other vias: 54.61,28.57
N$92  (via drill 0.95 pad 1.7)
  other vias: 24.13,28.57
N$93  (via drill 0.95 pad 1.7)
  other vias: 62.23,18.41
N$94  (via drill 0.95 pad 1.7)
  other vias: 29.21,18.41
N$95  (via drill 0.95 pad 1.7)
  other vias: 26.67,18.41
N$96  (via drill 0.95 pad 1.7)
  other vias: 59.69,28.57
N$105  (via drill 0.95 pad 1.7)
  other vias: 69.85,20.95
N$106  (via drill 0.95 pad 1.7)
  other vias: 29.21,20.95
N$107  (via drill 0.95 pad 1.7)
  other vias: 26.67,20.95
N$108  (via drill 0.95 pad 1.7)
  other vias: 62.23,26.04
N$114  (via drill 0.95 pad 1.7)
  other vias: 59.69,26.04
N$115  (via drill 0.95 pad 1.7)
  other vias: 59.69,20.95
N$117  (via drill 0.95 pad 1.7)
  other vias: 62.23,23.5
N$118  (via drill 0.95 pad 1.7)
  other vias: 21.59,20.95
N$119  (via drill 0.95 pad 1.7)
  other vias: 29.21,23.5
N$120  (via drill 0.95 pad 1.7)
  other vias: 26.67,23.5
N$122  (via drill 0.95 pad 1.7)
  other vias: 54.61,20.95
N$131  (via drill 0.95 pad 1.7)
  other vias: 29.21,26.04
N$132  (via drill 0.95 pad 1.7)
  other vias: 26.67,26.04
N$135  (via drill 0.95 pad 1.7)
  other vias: 26.67,28.57
N$141  (via drill 0.95 pad 1.7)
  other vias: 67.31,15.88
N$143  (via drill 0.95 pad 1.7)
  other vias: 29.21,28.57
N$153  (via drill 0.95 pad 1.7)
  other vias: 57.15,31.11
N$155  (via drill 0.95 pad 1.7)
  other vias: 29.21,31.11
N$156  (via drill 0.95 pad 1.7)
  other vias: 26.67,31.11
N$165  (via drill 0.95 pad 1.7)
  other vias: 52.07,33.66
N$167  (via drill 0.95 pad 1.7)
  other vias: 29.21,33.66
N$168  (via drill 0.95 pad 1.7)
  other vias: 26.67,33.66
N$177  (via drill 0.95 pad 1.7)
  other vias: 44.45,36.2
N$178  (via drill 0.95 pad 1.7)
  other vias: 67.31,31.11
N$179  (via drill 0.95 pad 1.7)
  other vias: 29.21,36.2
N$180  (via drill 0.95 pad 1.7)
  other vias: 26.67,36.2
N$185  (via drill 0.95 pad 1.7)
  other vias: 69.85,36.2
N$186  (via drill 0.95 pad 1.7)
  other vias: 69.85,31.11
N$187  (via drill 0.95 pad 1.7)
  other vias: 69.85,28.57
N$188  (via drill 0.95 pad 1.7)
  other vias: 69.85,26.04
N$189  (via drill 0.95 pad 1.7)
  other vias: 16.51,10.79
N$190  (via drill 0.95 pad 1.7)
  other vias: 21.59,18.41
N$191  (via drill 0.95 pad 1.7)
  other vias: 29.21,38.73
N$192  (via drill 0.95 pad 1.7)
  other vias: 26.67,38.73
N$193  (via drill 0.95 pad 1.7)
  other vias: 69.85,23.5
N$194  (via drill 0.95 pad 1.7)
  other vias: 69.85,18.41
N$197  (via drill 0.95 pad 1.7)
  other vias: 69.85,33.66
N$198  (via drill 0.95 pad 1.7)
  other vias: 72.39,31.11
N$199  (via drill 0.95 pad 1.7)
  other vias: 72.39,28.57
N$200  (via drill 0.95 pad 1.7)
  other vias: 72.39,26.04
N$202  (via drill 0.95 pad 1.7)
  other vias: 72.39,23.5
N$204  (via drill 0.95 pad 1.7)
  other vias: 72.39,20.95
N$205  (via drill 0.95 pad 1.7)
  other vias: 72.39,18.41
N$208  (via drill 0.95 pad 1.7)
  other vias: 72.39,36.2
N$209  (via drill 0.95 pad 1.7)
  other vias: 72.39,33.66
N$210  (via drill 0.95 pad 1.7)
  other vias: 74.93,15.88
N$211  (via drill 0.95 pad 1.7)
  other vias: 74.93,31.11
N$212  (via drill 0.95 pad 1.7)
  other vias: 74.93,28.57
N$213  (via drill 0.95 pad 1.7)
  other vias: 74.93,26.04
N$214  (via drill 0.95 pad 1.7)
  other vias: 74.93,23.5
N$215  (via drill 0.95 pad 1.7)
  other vias: 74.93,20.95
N$216  (via drill 0.95 pad 1.7)
  other vias: 74.93,18.41
N$219  (via drill 0.95 pad 1.7)
  other vias: 34.29,26.04
N$220  (via drill 0.95 pad 1.7)
  other vias: 36.83,26.04
N$221  (via drill 0.95 pad 1.7)
  other vias: 74.93,36.2
N$224  (via drill 0.95 pad 1.7)
  other vias: 74.93,33.66
N$225  (via drill 0.95 pad 1.7)
  other vias: 77.47,15.88
N$226  (via drill 0.95 pad 1.7)
  other vias: 77.47,31.11
N$227  (via drill 0.95 pad 1.7)
  other vias: 31.75,36.2
N$228  (via drill 0.95 pad 1.7)
  other vias: 34.29,36.2
N$229  (via drill 0.95 pad 1.7)
  other vias: 31.75,33.66
N$230  (via drill 0.95 pad 1.7)
  other vias: 34.29,33.66
N$231  (via drill 0.95 pad 1.7)
  other vias: 31.75,31.11
N$232  (via drill 0.95 pad 1.7)
  other vias: 34.29,31.11
N$233  (via drill 0.95 pad 1.7)
  other vias: 36.83,33.66
N$234  (via drill 0.95 pad 1.7)
  other vias: 36.83,31.11
N$235  (via drill 0.95 pad 1.7)
  other vias: 34.29,28.57
N$236  (via drill 0.95 pad 1.7)
  other vias: 36.83,28.57
N$237  (via drill 0.95 pad 1.7)
  other vias: 39.37,31.11
N$238  (via drill 0.95 pad 1.7)
  other vias: 39.37,33.66
N$239  (via drill 0.95 pad 1.7)
  other vias: 39.37,28.57
N$240  (via drill 0.95 pad 1.7)
  other vias: 41.91,31.11
N$241  (via drill 0.95 pad 1.7)
  other vias: 41.91,33.66
N$242  (via drill 0.95 pad 1.7)
  other vias: 39.37,36.2
N$243  (via drill 0.95 pad 1.7)
  other vias: 36.83,36.2
N$244  (via drill 0.95 pad 1.7)
  other vias: 77.47,28.57
N$245  (via drill 0.95 pad 1.7)
  other vias: 34.29,38.73
N$246  (via drill 0.95 pad 1.7)
  other vias: 36.83,38.73
N$247  (via drill 0.95 pad 1.7)
  other vias: 31.75,38.73
N$250  (via drill 0.95 pad 1.7)
  other vias: 77.47,26.04
N$251  (via drill 0.95 pad 1.7)
  other vias: 31.75,28.57
N$252  (via drill 0.95 pad 1.7)
  other vias: 31.75,26.04
N$253  (via drill 0.95 pad 1.7)
  other vias: 77.47,23.5
N$254  (via drill 0.95 pad 1.7)
  other vias: 77.47,20.95
N$255  (via drill 0.95 pad 1.7)
  other vias: 77.47,18.41
N$258  (via drill 0.95 pad 1.7)
  other vias: 77.47,36.2
N$259  (via drill 0.95 pad 1.7)
  other vias: 34.29,20.95
N$260  (via drill 0.95 pad 1.7)
  other vias: 77.47,33.66
N$261  (via drill 0.95 pad 1.7)
  other vias: 36.83,20.95
N$262  (via drill 0.95 pad 1.7)
  other vias: 39.37,20.95
N$263  (via drill 0.95 pad 1.7)
  other vias: 41.91,20.95
N$264  (via drill 0.95 pad 1.7)
  other vias: 80.01,15.88
N$265  (via drill 0.95 pad 1.7)
  other vias: 80.01,31.11
N$266  (via drill 0.95 pad 1.7)
  other vias: 80.01,28.57
N$267  (via drill 0.95 pad 1.7)
  other vias: 44.45,28.57
N$268  (via drill 0.95 pad 1.7)
  other vias: 41.91,28.57
N$269  (via drill 0.95 pad 1.7)
  other vias: 46.99,28.57
N$270  (via drill 0.95 pad 1.7)
  other vias: 80.01,26.04
N$271  (via drill 0.95 pad 1.7)
  other vias: 31.75,23.5
N$272  (via drill 0.95 pad 1.7)
  other vias: 31.75,20.95
N$273  (via drill 0.95 pad 1.7)
  other vias: 31.75,18.41
N$275  (via drill 0.95 pad 1.7)
  other vias: 34.29,15.88
N$276  (via drill 0.95 pad 1.7)
  other vias: 39.37,15.88
N$277  (via drill 0.95 pad 1.7)
  other vias: 36.83,15.88
N$280  (via drill 0.95 pad 1.7)
  other vias: 31.75,15.88
N$281  (via drill 0.95 pad 1.7)
  other vias: 39.37,18.41
N$282  (via drill 0.95 pad 1.7)
  other vias: 41.91,18.41
N$284  (via drill 0.95 pad 1.7)
  other vias: 67.31,28.57
N$285  (via drill 0.95 pad 1.7)
  other vias: 67.31,26.04
N$286  (via drill 0.95 pad 1.7)
  other vias: 67.31,23.5
N$287  (via drill 0.95 pad 1.7)
  other vias: 80.01,23.5
N$288  (via drill 0.95 pad 1.7)
  other vias: 80.01,20.95
N$289  (via drill 0.95 pad 1.7)
  other vias: 67.31,20.95
N$290  (via drill 0.95 pad 1.7)
  other vias: 67.31,18.41
N$291  (via drill 0.95 pad 1.7)
  other vias: 67.31,33.66
N$293  (via drill 0.95 pad 1.7)
  other vias: 41.91,15.88
N$294  (via drill 0.95 pad 1.7)
  other vias: 44.45,15.88
N$295  (via drill 0.95 pad 1.7)
  other vias: 44.45,18.41
N$296  (via drill 0.95 pad 1.7)
  other vias: 46.99,18.41
N$297  (via drill 0.95 pad 1.7)
  other vias: 46.99,20.95
N$298  (via drill 0.95 pad 1.7)
  other vias: 44.45,20.95
N$299  (via drill 0.95 pad 1.7)
  other vias: 49.53,20.95
N$300  (via drill 0.95 pad 1.7)
  other vias: 80.01,18.41
N$303  (via drill 0.95 pad 1.7)
  other vias: 80.01,36.2
N$304  (via drill 0.95 pad 1.7)
  other vias: 52.07,28.57
N$305  (via drill 0.95 pad 1.7)
  other vias: 49.53,28.57
N$306  (via drill 0.95 pad 1.7)
  other vias: 80.01,33.66
N$307  (via drill 0.95 pad 1.7)
  other vias: 46.99,31.11
N$308  (via drill 0.95 pad 1.7)
  other vias: 82.55,15.88
N$309  (via drill 0.95 pad 1.7)
  other vias: 52.07,31.11
N$310  (via drill 0.95 pad 1.7)
  other vias: 49.53,31.11
N$311  (via drill 0.95 pad 1.7)
  other vias: 44.45,31.11
N$312  (via drill 0.95 pad 1.7)
  other vias: 44.45,33.66
N$313  (via drill 0.95 pad 1.7)
  other vias: 46.99,33.66
N$314  (via drill 0.95 pad 1.7)
  other vias: 34.29,18.41
N$315  (via drill 0.95 pad 1.7)
  other vias: 36.83,18.41
N$316  (via drill 0.95 pad 1.7)
  other vias: 46.99,15.88
N$317  (via drill 0.95 pad 1.7)
  other vias: 49.53,18.41
N$318  (via drill 0.95 pad 1.7)
  other vias: 52.07,18.41
N$319  (via drill 0.95 pad 1.7)
  other vias: 52.07,20.95
N$320  (via drill 0.95 pad 1.7)
  other vias: 57.15,18.41
N$321  (via drill 0.95 pad 1.7)
  other vias: 69.85,15.88
N$323  (via drill 0.95 pad 1.7)
  other vias: 62.23,15.88
N$328  (via drill 0.95 pad 1.7)
  other vias: 82.55,31.11
N$329  (via drill 0.95 pad 1.7)
  other vias: 36.83,23.5
N$330  (via drill 0.95 pad 1.7)
  other vias: 82.55,28.57
N$331  (via drill 0.95 pad 1.7)
  other vias: 39.37,26.04
N$332  (via drill 0.95 pad 1.7)
  other vias: 39.37,23.5
N$333  (via drill 0.95 pad 1.7)
  other vias: 82.55,26.04
N$334  (via drill 0.95 pad 1.7)
  other vias: 82.55,23.5
N$335  (via drill 0.95 pad 1.7)
  other vias: 41.91,26.04
N$336  (via drill 0.95 pad 1.7)
  other vias: 34.29,23.5
N$337  (via drill 0.95 pad 1.7)
  other vias: 82.55,20.95
N$340  (via drill 0.95 pad 1.7)
  other vias: 82.55,18.41
N$343  (via drill 0.95 pad 1.7)
  other vias: 82.55,36.2
N$344  (via drill 0.95 pad 1.7)
  other vias: 82.55,33.66
N$345  (via drill 0.95 pad 1.7)
  other vias: 44.45,23.5
N$346  (via drill 0.95 pad 1.7)
  other vias: 41.91,23.5
N$347  (via drill 0.95 pad 1.7)
  other vias: 46.99,23.5
N$348  (via drill 0.95 pad 1.7)
  other vias: 52.07,23.5
N$349  (via drill 0.95 pad 1.7)
  other vias: 49.53,23.5
N$350  (via drill 0.95 pad 1.7)
  other vias: 52.07,26.04
N$351  (via drill 0.95 pad 1.7)
  other vias: 49.53,26.04
N$352  (via drill 0.95 pad 1.7)
  other vias: 46.99,26.04
N$376  (via drill 0.95 pad 1.7)
  other vias: 49.53,15.88
N$377  (via drill 0.95 pad 1.7)
  other vias: 52.07,15.88
N$378  (via drill 0.95 pad 1.7)
  other vias: 54.61,15.88
N$379  (via drill 0.95 pad 1.7)
  other vias: 57.15,15.88
N$380  (via drill 0.95 pad 1.7)
  other vias: 59.69,18.41
N$381  (via drill 0.95 pad 1.7)
  other vias: 54.61,18.41
N$382  (via drill 0.95 pad 1.7)
  other vias: 44.45,26.04
N$383  (via drill 0.95 pad 1.7)
  other vias: 57.15,20.95
N$384  (via drill 0.95 pad 1.7)
  other vias: 57.15,23.5
N$385  (via drill 0.95 pad 1.7)
  other vias: 62.23,20.95
N$386  (via drill 0.95 pad 1.7)
  other vias: 57.15,26.04
N$387  (via drill 0.95 pad 1.7)
  other vias: 54.61,26.04
N$388  (via drill 0.95 pad 1.7)
  other vias: 54.61,23.5
N$389  (via drill 0.95 pad 1.7)
  other vias: 21.59,13.34
N$390  (via drill 0.95 pad 1.7)
  other vias: 21.59,15.88
N$392  (via drill 0.95 pad 1.7)
  other vias: 19.05,13.34
N$393  (via drill 0.95 pad 1.7)
  other vias: 59.69,23.5
N$394  (via drill 0.95 pad 1.7)
  other vias: 19.05,15.88
N$395  (via drill 0.95 pad 1.7)
  other vias: 57.15,28.57
N$396  (via drill 0.95 pad 1.7)
  other vias: 62.23,28.57
N$398  (via drill 0.95 pad 1.7)
  other vias: 62.23,31.11
N$399  (via drill 0.95 pad 1.7)
  other vias: 59.69,31.11
N$400  (via drill 0.95 pad 1.7)
  other vias: 54.61,31.11
N$402  (via drill 0.95 pad 1.7)
  other vias: 59.69,33.66
N$403  (via drill 0.95 pad 1.7)
  other vias: 62.23,33.66
N$404  (via drill 0.95 pad 1.7)
  other vias: 64.77,36.2
N$405  (via drill 0.95 pad 1.7)
  other vias: 62.23,36.2
N$406  (via drill 0.95 pad 1.7)
  other vias: 59.69,36.2
N$407  (via drill 0.95 pad 1.7)
  other vias: 57.15,36.2
N$408  (via drill 0.95 pad 1.7)
  other vias: 57.15,33.66
N$409  (via drill 0.95 pad 1.7)
  other vias: 54.61,36.2
N$410  (via drill 0.95 pad 1.7)
  other vias: 54.61,33.66
N$411  (via drill 0.95 pad 1.7)
  other vias: 49.53,33.66
N$412  (via drill 0.95 pad 1.7)
  other vias: 52.07,36.2
N$413  (via drill 0.95 pad 1.7)
  other vias: 49.53,36.2
N$414  (via drill 0.95 pad 1.7)
  other vias: 46.99,36.2
N$415  (via drill 0.95 pad 1.7)
  other vias: 41.91,36.2
N$416  (via drill 0.95 pad 1.7)
  other vias: 39.37,38.73
N$417  (via drill 0.95 pad 1.7)
  other vias: 44.45,38.73
N$418  (via drill 0.95 pad 1.7)
  other vias: 41.91,38.73
N$419  (via drill 0.95 pad 1.7)
  other vias: 46.99,38.73
N$420  (via drill 0.95 pad 1.7)
  other vias: 49.53,38.73
N$421  (via drill 0.95 pad 1.7)
  other vias: 52.07,38.73
N$422  (via drill 0.95 pad 1.7)
  other vias: 54.61,38.73
N$468  (via drill 0.95 pad 1.7)
  other vias: 67.31,36.2
SCK  (via drill 0.61)  (5 unrouted)
  Top 0.152: v20.32,44.45 20.32,45.72 13.97,52.07
  Top 0.254: ICSP.3 6.99,52.07 13.97,52.07
  Bottom 0.254: JP9.33 94.46,12.7 93.19,13.97 92.23,13.97 90.96,12.7 JP10.33 88.9,12.7 85.72,15.88 85.72,43.18 84.45,44.45 v20.32,44.45
SO1
  Top 0.254: U1.1 4.45,22.54 3.81,21.91 JP1.1
SO2
  Top 0.254: U1.2 5.71,21.91 5.08,21.27 5.08,20 4.45,19.37 3.81,19.37 JP2.1
SO3
  Top 0.254: U1.3 6.99,22.54 6.35,21.91 JP1.2
SO4
  Top 0.254: U1.4 8.26,22.07 7.46,21.27 7.46,20.48 6.35,19.37 JP2.2
SO5
  Top 0.254: U1.5 9.53,22.54 8.89,21.91 JP1.3
SO6
  Top 0.254: U1.6 10.79,22.07 10.16,21.43 10.16,20.48 8.89,19.21 JP2.3
SO7
  Top 0.254: U1.7 12.06,22.54 11.43,21.91 JP1.4
SO8
  Top 0.254: U1.8 13.34,22.07 12.7,21.43 12.7,20.48 11.43,19.21 JP2.4
SO9
  Top 0.254: U1.9 14.61,22.54 13.97,21.91 JP1.5
SO10
  Top 0.254: U1.10 15.88,22.07 15.24,21.43 15.24,20.48 13.97,19.21 JP2.5
SO11
  Top 0.254: U1.11 17.14,22.54 16.51,21.91 JP1.6
SO12
  Top 0.254: U1.12 18.41,22.07 17.78,21.43 17.78,20.48 16.51,19.21 JP2.6
SO13
  Top 0.254: U1.13 19.68,22.54 19.05,21.91 JP1.7
SO14
  Top 0.254: U1.14 20.95,22.07 20.32,21.43 20.32,20.48 19.05,19.21 JP2.7
SO15
  Top 0.254: U1.15 20.95,35.08 20.32,35.72 20.32,36.67 19.05,37.94 JP6.7
SO16
  Top 0.254: U1.16 19.68,34.61 19.05,35.24 JP5.7
SO17
  Top 0.254: U1.17 18.41,35.08 17.78,35.72 17.78,36.67 16.51,37.94 JP6.6
SO18
  Top 0.254: U1.18 17.14,34.61 16.51,35.24 JP5.6
SO19
  Top 0.254: U1.19 15.88,35.08 15.24,35.72 15.24,36.67 13.97,37.94 JP6.5
SO20
  Top 0.254: U1.20 14.61,34.61 13.97,35.24 JP5.5
SO21
  Top 0.254: U1.21 13.34,35.08 12.7,35.72 12.7,36.67 11.43,37.94 JP6.4
SO22
  Top 0.254: U1.22 12.06,34.61 11.43,35.24 JP5.4
SO23
  Top 0.254: U1.23 10.79,35.08 10.16,35.72 10.16,36.67 8.89,37.94 JP6.3
SO24
  Top 0.254: U1.24 9.53,34.61 8.89,35.24 JP5.3
SO25
  Top 0.254: U1.25 8.26,35.08 7.46,35.88 7.46,36.67 6.35,37.78 JP6.2
SO26
  Top 0.254: U1.26 6.99,34.61 6.35,35.24 JP5.2
SO27
  Top 0.254: U1.27 5.71,35.24 5.08,35.88 5.08,37.15 4.45,37.78 3.81,37.78 JP6.1
SO28
  Top 0.254: U1.28 4.45,34.61 3.81,35.24 JP5.1
VIN
  Top 0.254: J12.6 41.83,13.26 41.83,5.94 J10.6
  Top 0.813: PWR.6 J10.6

### Text on the board
tPlace: ICSP | 9 | 8 | 7 | 6 | 5 | 4 | 3 | 2 | GND | 13 | 12 | 11 | 10 | AREF | SDA | SCL | TX>1 | RX<0 | TX31 | RX31 | TX21 | RX21 | TX11 | RX11 | RST | 3V3 | 5V | GND | GND | VIN | 0 | 1 | 2 | 3 | 4 | 5 | 6 | 7 | 9 | 9 | 10 | 11 | 12 | 13 | 14 | 15 | STAT | Arduino MEGA Prototype Shield v3 | PWR